# EAGLE design pinoccio-wifi (EAGLE 6.2)
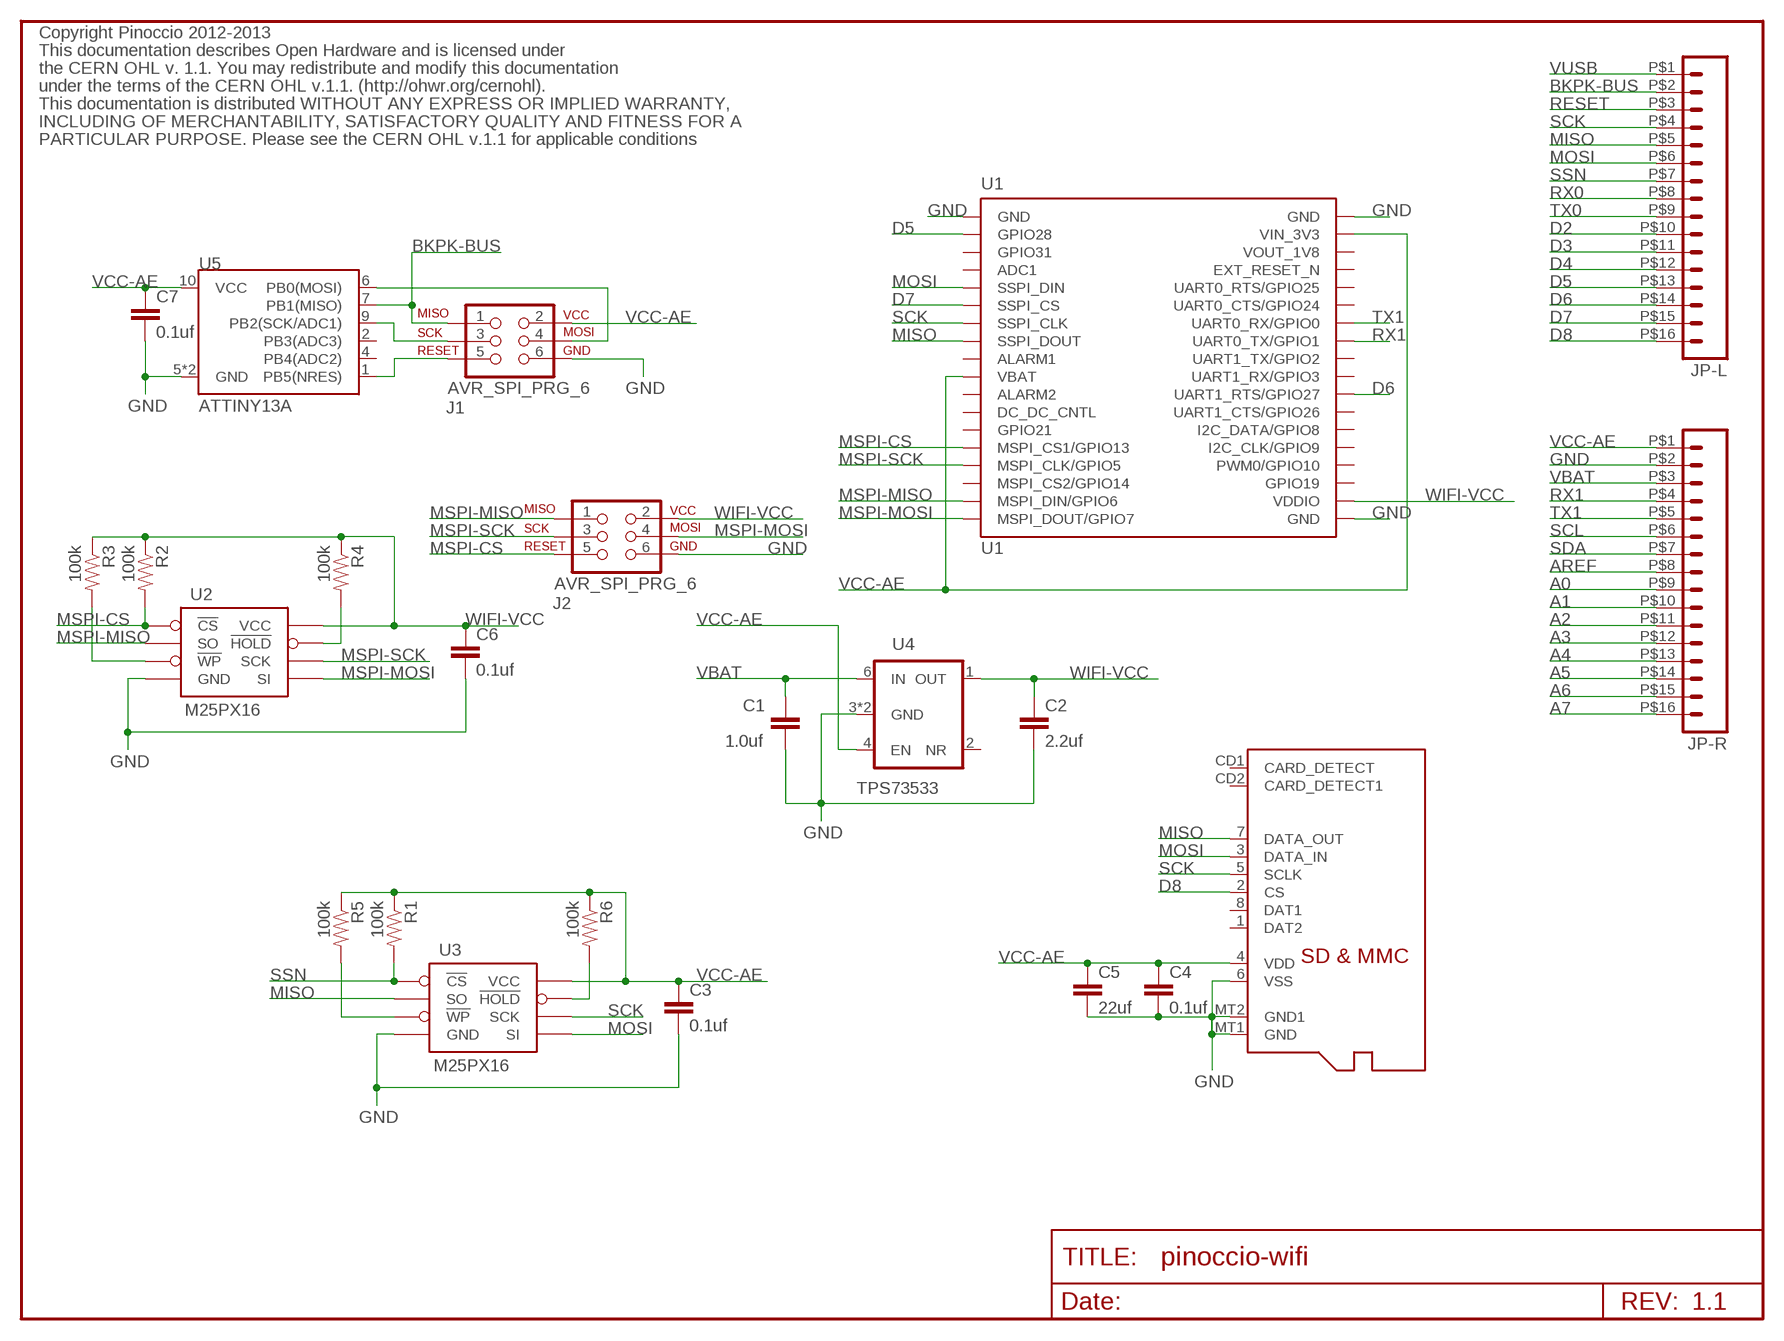
[diagram p0: schematic, sheet 1]

## Parts
C1  1.0uf  CAP0402-CAP  [0402-CAP]
C2  2.2uf  CAP0402-CAP  [0402-CAP]
C3  0.1uf  CAP0402-CAP  [0402-CAP]
C4  0.1uf  CAP0402-CAP  [0402-CAP]
C5  22uf  CAP0603-CAP  [0603-CAP]
C6  0.1uf  CAP0402-CAP  [0402-CAP]
C7  0.1uf  CAP0402-CAP  [0402-CAP]
J1  AVR_SPI_PRG_6  [2X3-PAD]
J2  AVR_SPI_PRG_6  [2X3-PAD]
JP-L  M162MM  [1X16_2MM]
JP-R  M162MM  [1X16_2MM]
R1  100k  RESISTOR0402-RES  [0402-RES]
R2  100k  RESISTOR0402-RES  [0402-RES]
R3  100k  RESISTOR0402-RES  [0402-RES]
R4  100k  RESISTOR0402-RES  [0402-RES]
R5  100k  RESISTOR0402-RES  [0402-RES]
R6  100k  RESISTOR0402-RES  [0402-RES]
U1  GS1011MIPS  [GS1011MIPS]
U2  M25PX16  M25PX16SO8N  [SO8N]
U3  M25PX16  M25PX16SO8N  [SO8N]
U4  TPS73533  LDO-TPS73533  [SON-6-DRV]
U5  ATTINY13A  ATTINY13QFN10  [QFN-10]
U$1  MICROSD  [MICROSD]

## Nets
A0: JP-R.P$9
A1: JP-R.P$10
A2: JP-R.P$11
A3: JP-R.P$12
A4: JP-R.P$13
A5: JP-R.P$14
A6: JP-R.P$15
A7: JP-R.P$16
AREF: JP-R.P$8
BKPK-BUS: J1.1 JP-L.P$2 U5.7(PB1(MISO))
D2: JP-L.P$10
D3: JP-L.P$11
D4: JP-L.P$12
D5: JP-L.P$13 U1.P$2(GPIO28)
D6: JP-L.P$14 U1.P$26(UART1_RTS/GPIO27)
D7: JP-L.P$15 U1.P$6(SSPI_CS)
D8: JP-L.P$16 U$1.2(CS)
GND [GND]: C1.2 C2.2 C3.2 C4.2 C5.2 C6.2 C7.2 J1.6 J2.6 JP-R.P$2 U1.P$1(GND) U1.P$19(GND) U1.P$36(GND) U2.4(GND) U3.4(GND) U4.3(GND) U4.PAD(GND) U5.5(GND) U5.EP(GND) U$1.6(VSS) U$1.MT1(GND) U$1.MT2(GND1)
MISO: JP-L.P$5 U1.P$8(SSPI_DOUT) U3.2(SO) U$1.7(DATA_OUT)
MOSI: JP-L.P$6 U1.P$5(SSPI_DIN) U3.5(SI) U$1.3(DATA_IN)
MSPI-CS: J2.5 R2.2 U1.P$14(MSPI_CS1/GPIO13) U2.1(!CS)
MSPI-MISO: J2.1 U1.P$17(MSPI_DIN/GPIO6) U2.2(SO)
MSPI-MOSI: J2.4 U1.P$18(MSPI_DOUT/GPIO7) U2.5(SI)
MSPI-SCK: J2.3 U1.P$15(MSPI_CLK/GPIO5) U2.6(SCK)
N$1: R3.2 U2.3(!WP)
N$2: J1.4 U5.6(PB0(MOSI))
N$3: J1.3 U5.9(PB2(SCK/ADC1))
N$4: J1.5 U5.1(PB5(NRES))
N$5: R4.2 U2.7(!HOLD)
N$6: R6.2 U3.7(!HOLD)
N$7: R5.2 U3.3(!WP)
RESET: JP-L.P$3
RX0: JP-L.P$8
RX1: JP-R.P$4 U1.P$29(UART0_TX/GPIO1)
SCK: JP-L.P$4 U1.P$7(SSPI_CLK) U3.6(SCK) U$1.5(SCLK)
SCL: JP-R.P$6
SDA: JP-R.P$7
SSN: JP-L.P$7 R1.2 U3.1(!CS)
TX0: JP-L.P$9
TX1: JP-R.P$5 U1.P$30(UART0_RX/GPIO0)
VBAT: C1.1 JP-R.P$3 U4.6(IN)
VCC-AE: C3.1 C4.1 C5.1 C7.1 J1.2 JP-R.P$1 R1.1 R5.1 R6.1 U1.P$10(VBAT) U1.P$35(VIN_3V3) U3.8(VCC) U4.4(EN) U5.10(VCC) U$1.4(VDD)
VUSB: JP-L.P$1
WIFI-VCC [VCC]: C2.1 C6.1 J2.2 R2.1 R3.1 R4.1 U1.P$20(VDDIO) U2.8(VCC) U4.1(OUT)
Unconnected: U1.P$3(GPIO31) U1.P$4(ADC1) U1.P$9(ALARM1) U1.P$11(ALARM2) U1.P$12(DC_DC_CNTL) U1.P$13(GPIO21) U1.P$16(MSPI_CS2/GPIO14) U1.P$21(GPIO19) U1.P$22(PWM0/GPIO10) U1.P$23(I2C_CLK/GPIO9) U1.P$24(I2C_DATA/GPIO8) U1.P$25(UART1_CTS/GPIO26) U1.P$27(UART1_RX/GPIO3) U1.P$28(UART1_TX/GPIO2) U1.P$31(UART0_CTS/GPIO24) U1.P$32(UART0_RTS/GPIO25) U1.P$33(EXT_RESET_N) U1.P$34(VOUT_1V8) U4.2(NR) U4.5(N/C) U5.2(PB3(ADC3)) U5.4(PB4(ADC2)) U$1.1(DAT2) U$1.8(DAT1) U$1.CD1(CARD_DETECT) U$1.CD2(CARD_DETECT1)

## Notes on the sheet
- Copyright Pinoccio 2012-2013
- This documentation describes Open Hardware and is licensed under
- the CERN OHL v. 1.1. You may redistribute and modify this documentation
- under the terms of the CERN OHL v.1.1. (http://ohwr.org/cernohl).
- This documentation is distributed WITHOUT ANY EXPRESS OR IMPLIED WARRANTY,
- INCLUDING OF MERCHANTABILITY, SATISFACTORY QUALITY AND FITNESS FOR A
- PARTICULAR PURPOSE. Please see the CERN OHL v.1.1 for applicable conditions
- 1.1
- /Volumes/Data/Users/eric/Desktop/pinoccio.bmp
- /Volumes/Data/Users/eric/Desktop/pinoccio-1in.bmp | /Volumes/Data/Users/eric/Desktop/pinoccio-full-3-4in.bmp | /Volumes/Data/Users/eric/Desktop/pinoccio-full-3-4in.bmp

## Library data of the parts
C1-C7 = Pinoccio:CAP: Capacitor Standard 0603 ceramic capacitor, and 0.1" leaded capacitor.
J1 J2 = Pinoccio:AVR_SPI_PRG_6: AVR ISP 6 Pin This is the reduced ISP connector for AVR programming. Common on Arduino. This footprint will take up less PCB space and can be used with a 10-pin to 6-pin adapter such as SKU: BOB-08508
JP-L JP-R = Pinoccio:M16
R1-R6 = Pinoccio:RESISTOR: Resistor Basic schematic elements and footprints for 0603, 1206, and PTH resistors.
U1 = Pinoccio:GS1011MIPS: Gainspan GS1011MIPS Wifi Module
U2 U3 = Pinoccio:M25PX16
U4 = Pinoccio:LDO-TPS73533: Voltage Regulator LDO 500mA, Low Quiescent Current, Ultra-LowNoise, High PSRR Low-Dropout Linear Regulator
U5 = Pinoccio:ATTINY13
U$1 = Pinoccio:MICROSD: Micro-SD / Transflash card holder with SPI pinout For the 3M #2908-05WB-MG

## Net classes
0 Default: width 0.203 mm
1 VCC: width 0.305 mm
2 LEDPower: width 0.203 mm
3 ButtonSignal: width 0.203 mm
4 RF Antenna: width 0.305 mm
5 GND: width 0.203 mm

## Board
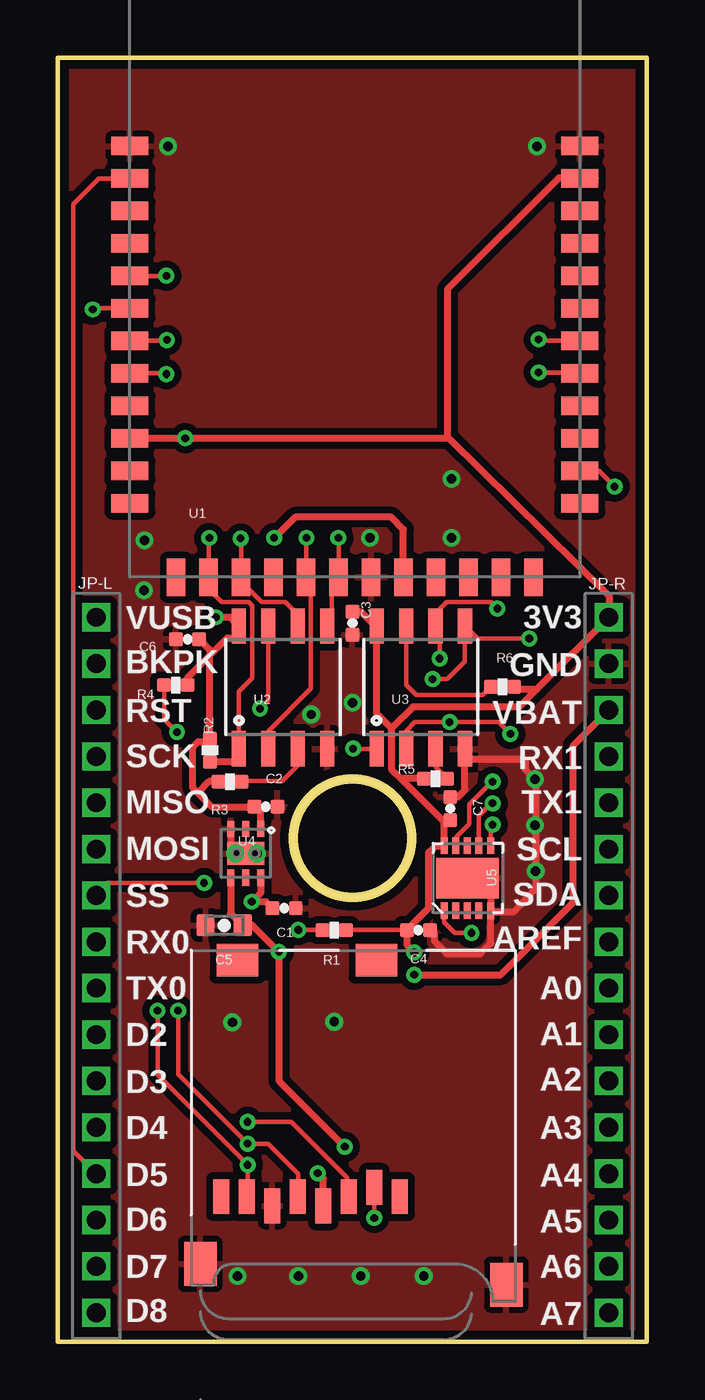
[diagram p1: board, top side]
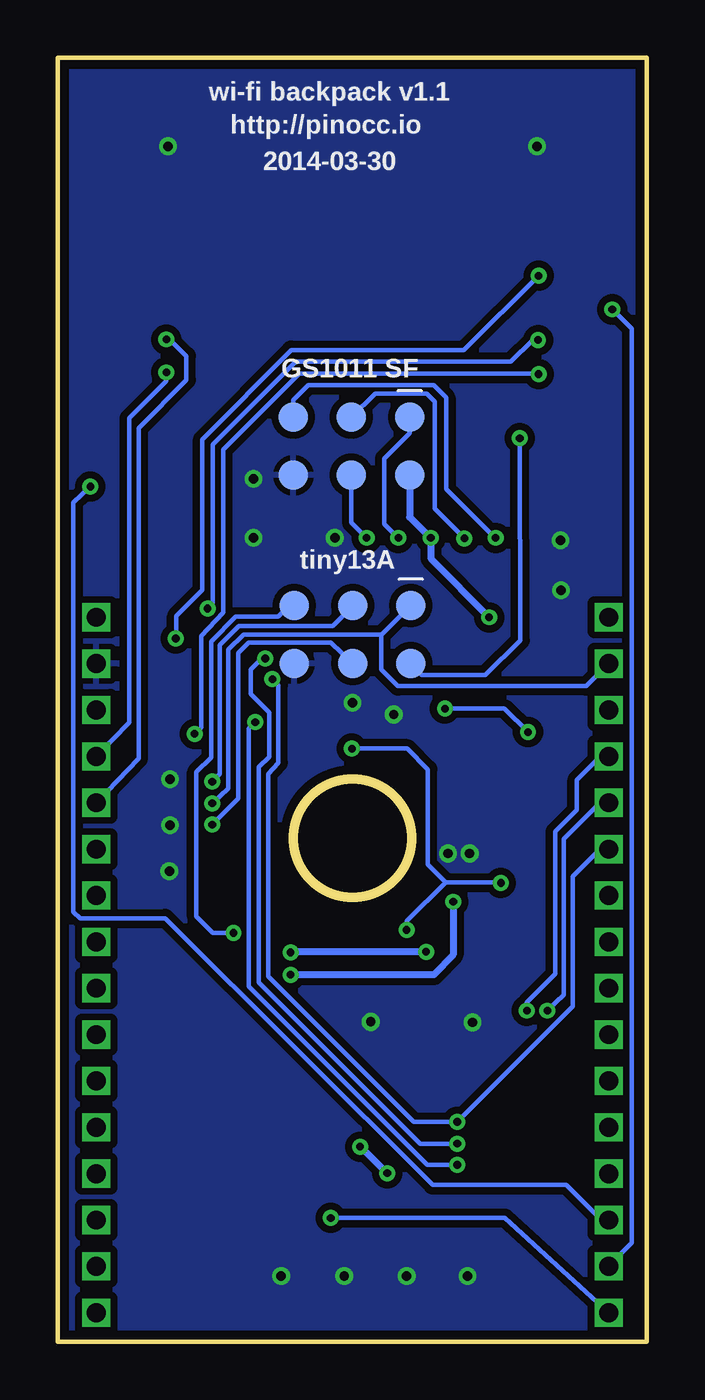
[diagram p2: board, bottom side, seen from below]

Size 25.4 x 55.37 mm. Coordinates in mm from the lower left corner, seen from the top.
Outline: 0,0 0,55.37 25.4,55.37 25.4,0 0,0
Outline: circle at 12.7,21.72 radius 2.54
Copper layers (1*16): Top 0.0356mm / dielectric 1.5011mm / Bottom 0.0356mm
Design rules: minimum track width 6mil, minimum drill 13mil, track to track 6mil, track to pad 6mil, pad to pad 6mil, via to via 6mil, smd to smd 6mil, copper to edge 15mil, drill to drill 6mil, minimum pad ring 7mil, minimum via ring 7mil, stop-mask expansion 4mil, vias tented up to drill 16mil, thermal gap 10mil
tKeepout: area 12.9,3.2 to 13.8,3.5; area 12.9,2.5 to 13.8,2.9; area 12.4,0.5 to 12.9,3.8; area 11.5,3.8 to 12.2,4.2; area 13.4,3.5 to 13.8,3.8; area 13.1,3.8 to 13.7,4.2; area 14.1,0.5 to 14.6,1.5; area 13.8,3.5 to 15.5,3.9; area 14.9,2.5 to 15.5,3.5; area 11.5,3.5 to 12,3.8; area 11.5,3.2 to 12.4,3.5

### Footprints (pad centres in the part's own frame; a part is rotated, then mirrored left to right if it is on the bottom)
0402-CAP = smd 0.6 x 0.6: 1 -0.5,0; 2 0.5,0
0603-CAP = smd 0.8 x 0.95: 1 -0.8,0; 2 0.8,0
2X3-PAD = smd 1.27 x 1.27: 1 0,0; 2 0,2.508; 3 2.508,0; 4 2.508,2.508; 5 5.016,0; 6 5.016,2.508
1X16_2MM = drill 0.813 square: P$1 0,0; P$2 2,0; P$3 4,0; P$4 6,0; P$5 8,0; P$6 10,0; P$7 12,0; P$8 14,0; P$9 16,0; P$10 18,0; P$11 20,0; P$12 22,0; P$13 24,0; P$14 26,0; P$15 28,0; P$16 30,0
0402-RES = smd 0.6 x 0.6: 1 -0.5,0; 2 0.5,0
GS1011MIPS = smd 1.6 x 0.8: P$1 0,18.6; P$2 0,17.2; P$3 0,15.8; P$4 0,14.4; P$5 0,13; P$6 0,11.6; P$7 0,10.2; P$8 0,8.8; P$9 0,7.4; P$10 0,6; P$11 0,4.6; P$12 0,3.2; P$25 19.4,3.2; P$26 19.4,4.6; P$27 19.4,6; P$28 19.4,7.4; P$29 19.4,8.8; P$30 19.4,10.2; P$31 19.4,11.6; P$32 19.4,13; P$33 19.4,14.4; P$34 19.4,15.8; P$35 19.4,17.2; P$36 19.4,18.6 | smd 0.8 x 1.6: P$13 2,0; P$14 3.4,0; P$15 4.8,0; P$16 6.2,0; P$17 7.6,0; P$18 9,0; P$19 10.4,0; P$20 11.8,0; P$21 13.2,0; P$22 14.6,0; P$23 16,0; P$24 17.4,0
SO8N = smd 0.61 x 1.524: 1 -1.905,-2.678; 2 -0.635,-2.678; 3 0.635,-2.678; 4 1.905,-2.678; 5 1.905,2.621; 6 0.635,2.621; 7 -0.635,2.621; 8 -1.905,2.621
SON-6-DRV = smd 0.3 x 0.7: 1 0.4,0; 2 1.05,0; 3 1.7,0; 4 1.7,2.1; 5 1.05,2.1; 6 0.4,2.1 | smd 1.6 x 1: PAD 1.05,1.05
QFN-10 = smd 0.7 x 0.3: 1 -1.4,1; 2 -1.4,0.5; 3 -1.4,0; 4 -1.4,-0.5; 5 -1.4,-1; 6 1.4,-1; 7 1.4,-0.5; 8 1.4,0; 9 1.4,0.5; 10 1.4,1 | smd 1.75 x 2.7: EP 0,0
MICROSD = smd 0.7 x 1.5: 1 9,-10.64; 2 7.9,-10.24; 3 6.8,-10.64; 4 5.7,-11.04; 5 4.6,-10.64; 6 3.5,-11.04; 7 2.4,-10.64; 8 1.3,-10.64 | smd 1.8 x 1.4: CD1 2,-0.44; CD2 8,-0.44 | smd 1.4 x 1.9: MT1 0.4,-13.54; MT2 13.6,-14.44

### Placement (x,y rotation side)
C1  9.75,18.69 0 top
C2  8.97,23.06 0 top
C3  12.7,30.99 270 top
C4  15.54,17.75 0 top
C5  7.16,17.96 180 top
C6  5.59,30.3 180 top
C7  16.92,22.99 90 top
J1  10.19,31.75 180 bottom
J2  10.24,39.88 180 bottom
JP-L  1.65,31.24 270 top
JP-R  23.75,31.24 270 top
R1  11.91,17.75 180 top
R2  6.55,25.5 270 top
R3  7.42,24.16 0 top
R4  5.08,28.32 180 top
R5  16.28,24.28 0 top
R6  19.18,28.24 180 top
U1  3.1,32.97 0 top
U2  9.7,28.24 0 top
U3  15.65,28.24 0 top
U4  9.15,22.11 180 top
U5  17.65,19.99 90 top
U$1  5.74,16.89 0 top

### Tracks (layer width: path | path; a pad name or v marks a point on that pad's centre or on a via)
BKPK-BUS  (via drill 0.33)
  Top 0.203: U5.7 18.14,21.18 18.14,22.68 18.67,23.22 v18.75,23.22
  Bottom 0.203: JP-L.P$2 2.62,28.27 10.74,28.27 11.46,28.98 11.46,30.48 11.43,30.51 | v18.75,23.22 18.06,23.85 18.06,29.84 17.4,30.51 11.43,30.51 | 11.43,30.51 J1.1
D5
  Top 0.203: JP-L.P$13 0.66,8.23 0.66,49.07 1.76,50.17 U1.P$2
D6  (via drill 0.33)
  Top 0.203: U1.P$26 23.32,37.57 v24,36.88
  Bottom 0.203: v24,36.88 24.74,36.2 24.74,18.54 24.43,18.26 20.78,18.26 9.25,6.76 3.48,6.76 2.03,5.31 JP-L.P$14
D7  (via drill 0.33)
  Top 0.203: v1.5,44.53 1.54,44.57 U1.P$6
  Bottom 0.203: JP-L.P$15 0.66,4.26 0.66,43.69 v1.5,44.53 1.42,44.53
D8  (via drill 0.33)
  Top 0.203: U$1.2 v13.64,5.33
  Bottom 0.203: v13.64,5.33 6.12,5.33 JP-L.P$16
GND  (via drill 0.41)
  Top 0.305: U4.3 7.45,21.26 v7.64,21.06 | U5.5 18.7,18.54 19.66,18.54 20.62,19.56 20.62,24.03 20.6,24.05 20.6,24.51 | C4.2 16.23,17.57 16.23,17.27 16.76,16.74 18.21,16.74 18.67,17.2 18.67,18.57 U5.5 | v20.57,24.26 20.14,24.69 20.14,25.07 20.09,25.12 17.58,25.12 17.55,25.09 U3.4 17.55,23.8 17.24,23.49 C7.2 | U5.EP 18.21,19.99 18.67,19.53 18.67,18.61 U5.5
  other vias: 7.75,2.82 10.36,2.82 13.06,2.82 15.77,2.82 4.75,51.56 20.65,51.56 8.59,21.06 10.92,27.05 12.7,27.56 11.91,13.79 7.52,13.77 20.57,22.28 20.6,20.29 13.46,34.67 16.97,34.67 16.97,37.21 3.73,34.57 3.71,32.41
  pour Top (isolate 0.305): -0.03,55.42 25.32,55.47 25.37,43.94 25.4,42.66 25.39,42.16 25.35,32.28 25.37,31.22 25.37,31.01 25.45,5.7 25.4,0 0.03,0 -0.03,12.25 -0.05,31.29 -0.05,42.49 0.05,42.49 -0.05,43.81
  pour Bottom (isolate 0.305): -0.03,55.42 25.4,55.5 25.43,42.7 25.43,42.62 25.35,42.62 25.35,32.28 25.37,31.09 25.37,25.35 25.4,5.67 25.4,0 0.58,0 -0.1,-0.09 0,12.23 -0.05,31.34 -0.05,31.55 0,32.31 0,42.67
MISO  (via drill 0.33)
  Top 0.203: U$1.7 8.18,6.29 v8.18,7.62 4.29,11.51 v4.29,14.27 | 15.01,25.3 U3.2 15.01,26.34 15.39,26.72 v16.89,26.72 19,26.72 v19.51,26.21 | v4.67,41.73 4.64,41.77 U1.P$8
  Bottom 0.203: v8.18,7.62 9.47,7.62 17.17,15.32 17.17,26.44 v16.89,26.72 | v4.29,14.27 3.58,14.96 3.58,21.69 2.03,23.24 JP-L.P$5 | v19.51,26.21 19.23,26.49 19.23,30.43 18.26,31.45 18.26,38.48 14.99,41.76 4.7,41.76 v4.67,41.73
MOSI  (via drill 0.33)
  Top 0.203: U$1.3 12.47,6.32 12.47,7.06 10.06,9.47 v8.18,9.47 | v4.67,45.97 U1.P$5 | v20.32,30.33 18.11,30.33 U3.5 17.55,29.34 16.79,28.58 v16.15,28.58
  Bottom 0.203: JP-L.P$6 2.03,21.23 3.2,20.07 3.2,14.45 v8.18,9.47 10.06,9.47 16.33,15.75 16.33,24.49 15.9,24.97 15.9,28.32 v16.15,28.58 | v20.32,30.33 20.3,30.35 20.3,31.29 19.18,32.41 19.18,38.91 15.34,42.77 7.9,42.77 v4.67,45.97
MSPI-CS  (via drill 0.33)
  Top 0.203: U2.1 7.8,28.04 8.38,28.63 8.38,31.75 8.23,31.9 7.06,31.9 6.55,32.41 6.55,32.91 U1.P$14 | 6.5,32.67 U1.P$14 | U1.P$14 6.5,34.64 v6.53,34.67
  Top 0.305: R2.2 6.57,25.02 7.77,25.02 7.8,25.04 U2.1
  Bottom 0.203: J2.5 15.25,40.6 14.61,41.25 9.2,41.25 8.66,40.72 8.66,36.78 6.55,34.67 v6.53,34.67
MSPI-MISO  (via drill 0.33)
  Top 0.203: U2.2 9.07,26.31 10.9,28.17 10.9,32.77 U1.P$17 10.7,34.63 v10.72,34.67
  Bottom 0.203: J2.1 10.24,39.19 11.33,38.1 11.33,35.26 v10.72,34.67
MSPI-MOSI  (via drill 0.33)
  Top 0.203: U2.5 11.81,30.61 11.81,32.46 12.1,32.65 U1.P$18 v12.1,34.66 v12.09,34.67
  Bottom 0.203: J2.4 12.74,35.33 v12.09,34.67
MSPI-SCK  (via drill 0.33)
  Top 0.203: U2.6 10.34,31.37 9.8,31.9 8.79,31.9 7.87,32.82 U1.P$15 7.9,34.62 v7.87,34.65
  Bottom 0.203: J2.3 11.73,40.89 9.5,40.89 9.14,40.54 9.14,35.94 7.87,34.67 v7.87,34.65
N$1
  Top 0.203: U2.3 10.34,24.84 9.68,24.18 7.94,24.18 R3.2
N$2  (via drill 0.33)
  Top 0.203: U5.6 18.65,22.21 v18.75,22.3
  Bottom 0.203: v18.75,22.3 17.63,23.42 17.63,29.69 17.17,30.15 13.63,30.15 J1.4
N$3  (via drill 0.33)
  Top 0.203: U5.9 17.17,21.36 17.17,21.77 17.73,22.33 17.73,23.16 18.72,24.16 v18.75,24.16
  Bottom 0.203: J1.3 13.56,30.86 17.6,30.86 18.41,30.05 18.41,24.49 v18.75,24.16
N$4  (via drill 0.33)
  Top 0.203: v17.83,17.63 17.12,17.63 16.66,18.09 16.66,18.58 U5.1
  Bottom 0.203: J1.5 15.44,31.73 15.9,31.27 17.73,31.27 18.8,30.2 18.8,25.2 19.43,24.56 19.43,18.34 18.72,17.63 v17.83,17.63
N$5  (via drill 0.33)
  Top 0.203: U2.7 9.07,27.66 v8.71,27.3 | R4.2 4.58,26.84 v5.13,26.29
  Bottom 0.203: v5.13,26.29 6.15,27.3 v8.71,27.3
N$6
  Top 0.203: R6.2 18.32,27.89 15.44,27.89 15.01,28.32 U3.7
N$7
  Top 0.203: U3.3 16.28,24.78 R5.2
RX1  (via drill 0.33)
  Top 0.203: v20.73,41.81 22.54,41.81 | 22.54,41.81 23.06,41.81 | U1.P$29 22.54,41.81
  Bottom 0.203: JP-R.P$4 22.33,26.72 22.33,39.83 20.73,41.43 v20.73,41.81
SCK  (via drill 0.33)
  Top 0.203: 10.34,6.37 U$1.5 10.36,6.27 10.36,7.24 9.07,8.53 v8.18,8.53 5.18,11.53 v5.18,14.27 | v18.95,31.62 18.69,31.9 16.76,31.9 16.28,31.42 U3.6 16.46,30.69 v16.46,29.46 | U1.P$7 4.66,43.17 v4.7,43.2
  Bottom 0.203: v8.18,8.53 9.78,8.53 16.74,15.49 16.74,24.79 16.28,25.22 16.28,27.13 17.09,27.94 17.09,28.98 16.61,29.46 v16.46,29.46 | v5.18,14.27 5.18,14.63 3.96,15.85 3.96,22 3.02,22.94 3.02,24.23 2.03,25.22 JP-L.P$4 | v18.95,31.62 18.72,31.85 18.72,38.68 15.14,42.27 5.87,42.27 4.93,43.2 v4.7,43.2
SSN  (via drill 0.33)
  Top 0.203: v6.3,19.79 2.12,19.79 JP-L.P$7 | U3.1 12.74,25.57 v12.72,25.58 | R1.2 v10.36,17.75
  Bottom 0.203: 8.69,19.81 9.45,20.57 9.45,24.69 10.34,25.58 v12.72,25.58 | 8.69,19.81 6.33,19.81 v6.3,19.79 | v10.36,17.75 10.36,18.14 8.69,19.81
TX1  (via drill 0.33)
  Top 0.203: v20.73,43.23 20.79,43.17 U1.P$30
  Bottom 0.203: JP-R.P$5 21.92,25.15 21.92,39.4 19.86,41.48 19.86,42.52 20.57,43.23 v20.73,43.23
VBAT  (via drill 0.33)
  Top 0.305: v15.37,15.82 19.1,15.82 22.23,18.95 22.23,25.72 JP-R.P$3 | U4.6 8.75,19.36 v8.36,18.97 8.97,18.97 C1.1
  Bottom 0.305: v8.36,18.97 8.36,16.69 9.2,15.82 v15.37,15.82
VCC-AE  (via drill 0.33)
  Top 0.203: R1.1 C4.1
  Top 0.305: 23.19,50.17 U1.P$35 22.48,50.19 21.59,50.19 16.79,45.39 16.79,39.04 16.86,38.97 | U1.P$10 v5.49,38.97 16.86,38.97 | 20.65,28.14 JP-R.P$1 23.77,31.22 23.77,32.16 16.86,38.97 | 20.65,28.14 19.89,27.38 15.32,27.38 14.4,26.47 14.38,26.47 | v12.37,8.41 9.53,11.25 v9.53,16.82 8.38,17.96 C5.1 7.45,18.48 U4.4 | U$1.4 11.44,7.03 v11.2,7.26 | v15.37,16.79 15.04,17.11 C4.1 15.98,18.69 15.98,21.08 16.28,21.39 U5.10 16.65,21.41 16.65,22.37 C7.1 16.68,22.49 16.66,22.53 16.56,22.5 14.8,24.27 | C3.1 13.06,31.49 13.74,30.81 U3.8 13.74,27.1 14.38,26.47 | 14.38,26.47 14.38,24.69 14.8,24.27 | R5.1 14.81,24.28 14.8,24.27 | R6.1 19.78,28.14 20.65,28.14
  Bottom 0.203: 9.84,29.57 J1.2 9.72,28.75 6.99,28.75 5.46,30.25 v5.49,38.97
  Bottom 0.305: v9.53,16.82 15.42,16.82 v15.37,16.79 | v12.37,8.41 12.34,8.41 v11.2,7.26
WIFI-VCC  (via drill 0.33)
  Top 0.305: 14.9,32.59 U1.P$20 14.9,35.04 14.38,35.56 10.24,35.56 v9.32,34.67 | U4.1 8.75,22.86 C2.1 8.46,23.07 6.62,23.07 6.02,23.67 | 6.55,29.6 R2.1 6.54,25.88 6.04,25.88 5.82,25.65 5.82,23.88 6.02,23.67 | 6.55,29.6 7.31,30.35 7.85,30.35 U2.8 7.42,31.24 v6.81,31.24 | R3.1 6.5,24.16 6.02,23.67 | R4.1 5.58,28.62 6.55,29.6 | C6.1 6.55,29.84 6.55,29.6
  Bottom 0.305: 9.99,37.37 J2.2 10.24,35.56 v9.32,34.67 9.32,33.78 v6.81,31.24

### Text on the board
tPlace: 3V3 | VUSB | GND | BKPK | VBAT | RST | RX1 | SCK | TX1 | MISO | SCL | MOSI | SDA | SS | AREF | RX0 | A0 | TX0 | A1 | D2 | A2 | D3 | A3 | D4 | A4 | D5 | A5 | D6 | A6 | D7 | A7 | D8
bPlace: wi-fi backpack v1.1 | http://pinocc.io | 2014-03-30 | GS1011 SF | tiny13A
tDocu: Pinoccio(tm) Wi-Fi Backpack v1.1 | Design by: Eric Jennings for Pinoccio | http://pinocc.io | Licensed under CERN OHL v.1.1